# EAGLE schematic stm32f303_devboard (EAGLE 6.3)
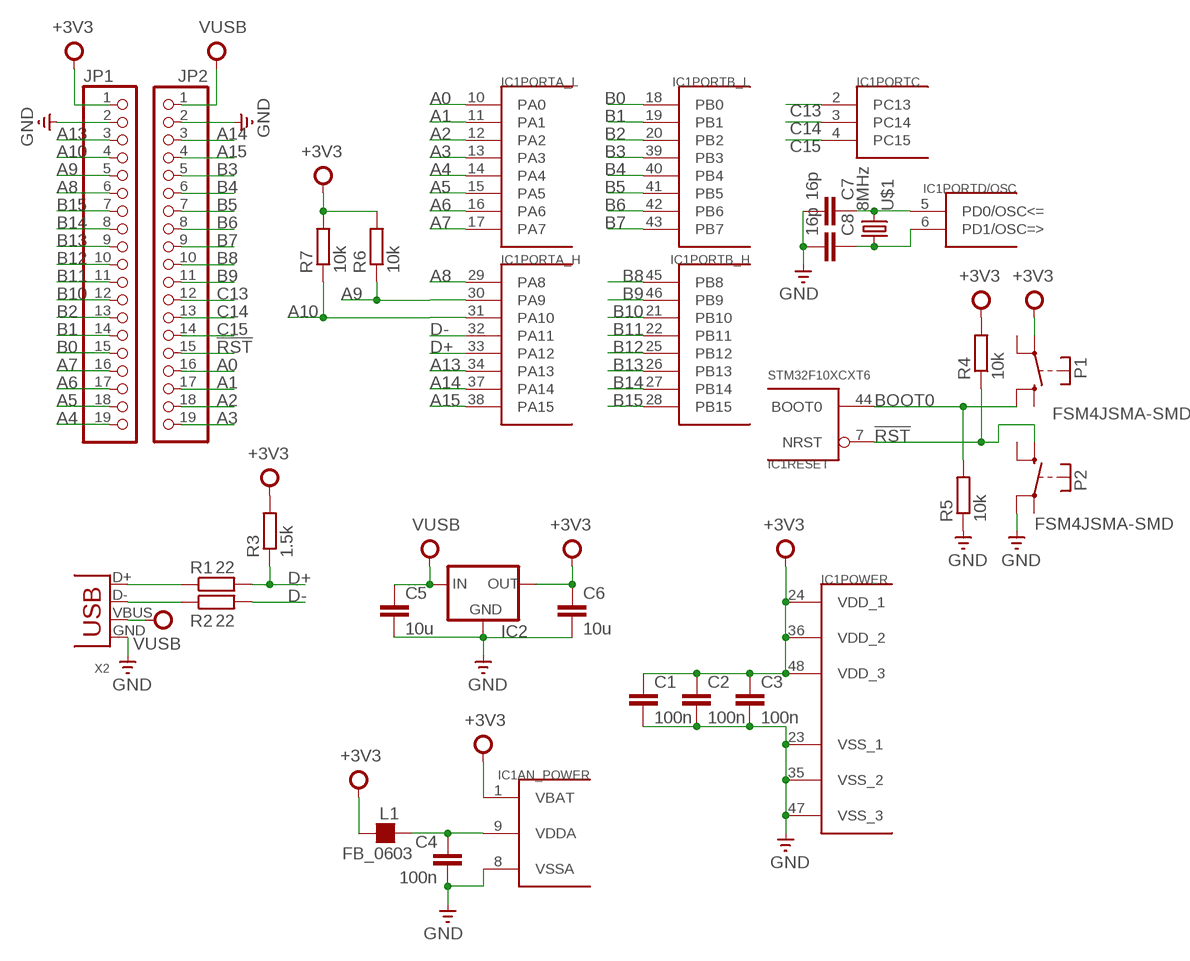
[diagram p0: schematic, sheet 1]

## Parts
C1  100n  C-EUC0603  [C0603]
C2  100n  C-EUC0603  [C0603]
C3  100n  C-EUC0603  [C0603]
C4  100n  C-EUC0603  [C0603]
C5  10u  C-EUC0805  [C0805]
C6  10u  C-EUC0805  [C0805]
C7  16p  C-EUC0603  [C0603]
C8  16p  C-EUC0603  [C0603]
IC1  STM32F10XCXT6  [TQFP48]
IC2  LM1117  [SOT223]
JP1  PINHD-1X19  [1X19]
JP2  PINHD-1X19  [1X19]
L1  FB_0603  [L0603]
P1  FSM4JSMA-SMD  [FSM4JSMA-SMD]
P2  FSM4JSMA-SMD  [FSM4JSMA-SMD]
R1  22  R-EU_R0603  [R0603]
R2  22  R-EU_R0603  [R0603]
R3  1.5k  R-EU_R0603  [R0603]
R4  10k  R-EU_R0603  [R0603]
R5  10k  R-EU_R0603  [R0603]
R6  10k  R-EU_R0603  [R0603]
R7  10k  R-EU_R0603  [R0603]
U$1  8MHz  7A  [2-SMD]
X2  USB-MB-S  [USB-MB-S]

## Nets
!RST!: IC1.7(RESET:NRST) JP2.15 P2.P$3(S) R4.1
+3V3: C1.1 C2.1 C3.1 C6.1 IC1.1(AN_POWER:VBAT) IC1.24(POWER:VDD_1) IC1.36(POWER:VDD_2) IC1.48(POWER:VDD_3) IC2.2(OUT) IC2.4(OUT) JP1.1 L1.2 P1.P$1(P) R3.2 R4.2 R6.2 R7.2
A0: IC1.10(PORTA_L:PA0) JP2.16
A1: IC1.11(PORTA_L:PA1) JP2.17
A2: IC1.12(PORTA_L:PA2) JP2.18
A3: IC1.13(PORTA_L:PA3) JP2.19
A4: IC1.14(PORTA_L:PA4) JP1.19
A5: IC1.15(PORTA_L:PA5) JP1.18
A6: IC1.16(PORTA_L:PA6) JP1.17
A7: IC1.17(PORTA_L:PA7) JP1.16
A8: IC1.29(PORTA_H:PA8) JP1.6
A9: IC1.30(PORTA_H:PA9) JP1.5 R6.1
A10: IC1.31(PORTA_H:PA10) JP1.4 R7.1
A13: IC1.34(PORTA_H:PA13) JP1.3
A14: IC1.37(PORTA_H:PA14) JP2.3
A15: IC1.38(PORTA_H:PA15) JP2.4
B0: IC1.18(PORTB_L:PB0) JP1.15
B1: IC1.19(PORTB_L:PB1) JP1.14
B2: IC1.20(PORTB_L:PB2) JP1.13
B3: IC1.39(PORTB_L:PB3) JP2.5
B4: IC1.40(PORTB_L:PB4) JP2.6
B5: IC1.41(PORTB_L:PB5) JP2.7
B6: IC1.42(PORTB_L:PB6) JP2.8
B7: IC1.43(PORTB_L:PB7) JP2.9
B8: IC1.45(PORTB_H:PB8) JP2.10
B9: IC1.46(PORTB_H:PB9) JP2.11
B10: IC1.21(PORTB_H:PB10) JP1.12
B11: IC1.22(PORTB_H:PB11) JP1.11
B12: IC1.25(PORTB_H:PB12) JP1.10
B13: IC1.26(PORTB_H:PB13) JP1.9
B14: IC1.27(PORTB_H:PB14) JP1.8
B15: IC1.28(PORTB_H:PB15) JP1.7
BOOT0: IC1.44(RESET:BOOT0) P1.P$4(S) R5.2
C13: IC1.2(PORTC:PC13) JP2.12
C14: IC1.3(PORTC:PC14) JP2.13
C15: IC1.4(PORTC:PC15) JP2.14
D+: IC1.33(PORTA_H:PA12) R1.2 R3.1
D-: IC1.32(PORTA_H:PA11) R2.2
GND: C1.2 C2.2 C3.2 C4.2 C5.2 C6.2 C7.2 C8.2 IC1.8(AN_POWER:VSSA) IC1.23(POWER:VSS_1) IC1.35(POWER:VSS_2) IC1.47(POWER:VSS_3) IC2.1(GND) JP1.2 JP2.2 P2.P$2(P) R5.1 X2.GND
N$1: C7.1 IC1.5(PORTD/OSC:PD0/OSC<=) U$1.P$2
N$2: R1.1 X2.D+
N$3: R2.1 X2.D-
N$4: C8.1 IC1.6(PORTD/OSC:PD1/OSC=>) U$1.P$1
N$5: C4.1 IC1.9(AN_POWER:VDDA) L1.1
VUSB: C5.1 IC2.3(IN) JP2.1 X2.VBUS
Unconnected: P1.P$2(P) P1.P$3(S) P2.P$1(P) P2.P$4(S)

## Library data of the parts
C1-C8 = rcl:C-EU: CAPACITOR, European symbol
IC1 = stm32:STM32F10XCXT6: ST STM32F101/103 48pin LQFP
IC2 = v-reg-2:LM1117
JP1 JP2 = pinhead:PINHD-1X19: PIN HEADER
L1 = rc-master:FB_: FERRITE BEAD
P1 P2 = switch-misc:FSM4JSMA-SMD: TYCO SWITCH
R1-R7 = rcl:R-EU_: RESISTOR, European symbol
U$1 = txc-7a:7A
X2 = con-usb-3:USB: USB Connectors